# Altium project Ornament.PrjPCB
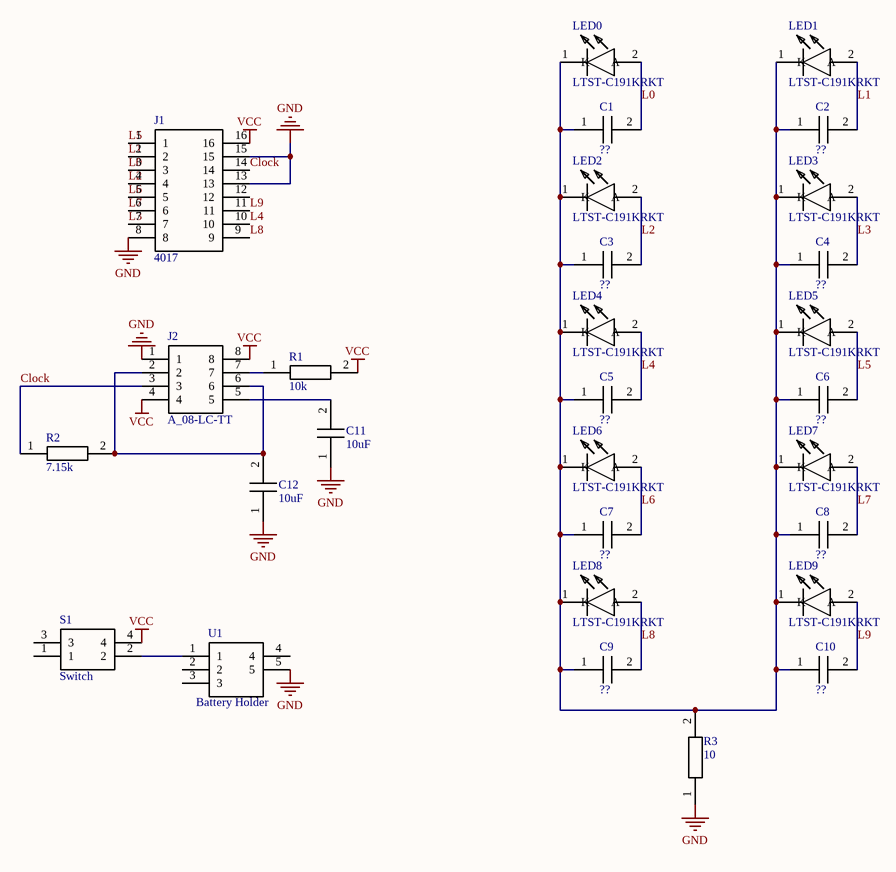
[diagram p0: Ornament.SchDoc]
1 sheet, 29 parts. Net scope: global (net labels, ports and power ports of the same name join across sheets).
Board file: Ornament.PcbDoc

## Sheet Ornament.SchDoc
size A

### Parts
C1  ??  [CAPC2013X140N]
C2  ??  [CAPC2013X140N]
C3  ??  [CAPC2013X140N]
C4  ??  [CAPC2013X140N]
C5  ??  [CAPC2013X140N]
C6  ??  [CAPC2013X140N]
C7  ??  [CAPC2013X140N]
C8  ??  [CAPC2013X140N]
C9  ??  [CAPC2013X140N]
C10  ??  [CAPC2013X140N]
C11  10uF  [CAPC2013X140N]
C12  10uF  [CAPC2013X140N]
J1  4017  [DIPS762W80P254L2019H533Q16N]
J2  A_08-LC-TT  [DIPS762W61P254L1016H525Q8N]
LED0  LTST-C191KRKT  [LEDC1608X55N]
LED1  LTST-C191KRKT  [LEDC1608X55N]
LED2  LTST-C191KRKT  [LEDC1608X55N]
LED3  LTST-C191KRKT  [LEDC1608X55N]
LED4  LTST-C191KRKT  [LEDC1608X55N]
LED5  LTST-C191KRKT  [LEDC1608X55N]
LED6  LTST-C191KRKT  [LEDC1608X55N]
LED7  LTST-C191KRKT  [LEDC1608X55N]
LED8  LTST-C191KRKT  [LEDC1608X55N]
LED9  LTST-C191KRKT  [LEDC1608X55N]
R1  10k  [RESC2012X60N]
R2  7.15k  [RESC2012X60N]
R3  10  [RESC2012X60N]
S1  Switch  [TL3305AF160QG]
U1  Battery Holder  [BATHLD001THM]

### Nets
GND: C11.1(C1) C12.1(C1) J1.8 J1.13 J1.15 J2.1 R3.1 U1.5
VCC: J1.16 J2.4 J2.8 R1.2 S1.4
Clock: J1.14 J2.3 R2.1
L0: C1.2(C2) J1.3 LED0.2(A)
L1: C2.2(C2) J1.2 LED1.2(A)
L2: C3.2(C2) J1.4 LED2.2(A)
L3: C4.2(C2) J1.7 LED3.2(A)
L4: C5.2(C2) J1.10 LED4.2(A)
L5: C6.2(C2) J1.1 LED5.2(A)
L6: C7.2(C2) J1.5 LED6.2(A)
L7: C8.2(C2) J1.6 LED7.2(A)
L8: C9.2(C2) J1.9 LED8.2(A)
L9: C10.2(C2) J1.11 LED9.2(A)
NetC1_1: C1.1(C1) C2.1(C1) C3.1(C1) C4.1(C1) C5.1(C1) C6.1(C1) C7.1(C1) C8.1(C1) C9.1(C1) C10.1(C1) LED0.1(K) LED1.1(K) LED2.1(K) LED3.1(K) LED4.1(K) LED5.1(K) LED6.1(K) LED7.1(K) LED8.1(K) LED9.1(K) R3.2
NetC11_2: C11.2(C2) J2.5
NetC12_2: C12.2(C2) J2.2 J2.6 R2.2
NetJ2_7: J2.7 R1.1
NetS1_2: S1.2 U1.1

Not connected (* = marked no-connect by the designer): J1 12; S1 1 3; U1 2 3 4

### Library data of the parts
C1-C12 = C0805C106K8PACTU: Capacitor; Manufacturer_Name: Kemet; Allied_Number: 70096892; Datasheet Link: http://componentsearchengine.com/Datasheets/3/C0805C106K8PACTU.pdf; Manufacturer_Part_Number: C0805C106K8PACTU; Mouser Part Number: 80-C0805C106K8P; Mouser Price/Stock: https://www.mouser.com/Search/Refine.aspx?Keyword=80-C0805C106K8P; RS Part Number: 8029850P; RS Price/Stock: http://uk.rs-online.com/web/p/products/8029850P; Allied Price/Stock: https://www.alliedelec.com/kemet-c0805c106k8pactu/70096892/
J1 = 4816-3000-CP: Connector; Manufacturer_Name: 3M; Allied_Number: 70237684; Datasheet Link: https://rs.componentsearchengine.com/Datasheets/2/4816-3000-CP.pdf; Height: 5.334mm; Manufacturer_Part_Number: 4816-3000-CP; Mouser Part Number: 517-4816-3000-CP; Mouser Price/Stock: https://www.mouser.com/Search/Refine.aspx?Keyword=517-4816-3000-CP; Allied Price/Stock: https://www.alliedelec.com/3m-4816-3000-cp/70237684/
J2 = A_08-LC-TT: Connector; Manufacturer_Name: ASSMANN WSW components GmbH; Manufacturer_Part_Number: A 08-LC-TT; Datasheet Link: http://www.assmann-wsw.com/fileadmin/datasheets/ASS_0810_CO.pdf; Height: 5.25mm; RS Part Number: 6742435P; RS Price/Stock: http://uk.rs-online.com/web/p/products/6742435P
LED0-LED9 = LTST-C191KRKT: LED; Manufacturer_Name: Lite-On; Datasheet Link: http://www.mouser.com/ds/2/239/S_110_LTST-C191KRKT-539838.pdf; Height: 0.55mm; Manufacturer_Part_Number: LTST-C191KRKT; Mouser Part Number: 859-LTST-C191KRKT; Mouser Price/Stock: https://www.mouser.com/Search/Refine.aspx?Keyword=859-LTST-C191KRKT; RS Part Number: 1278415P; RS Price/Stock: http://uk.rs-online.com/web/p/products/1278415P
R1-R3 = ERA6AEB7151V: Resistor; Manufacturer_Name: Panasonic; Allied_Number: 70360736; Datasheet Link: https://industrial.panasonic.com/cdbs/www-data/pdf/RDM0000/AOA0000C307.pdf; Height: 0.6mm; Manufacturer_Part_Number: ERA6AEB7151V; RS Part Number: 7426134; RS Price/Stock: https://uk.rs-online.com/web/p/products/7426134; Allied Price/Stock: https://www.alliedelec.com/panasonic-era6aeb7151v/70360736/
S1 = TL3305AF160QG: Manufacturer_Name: E-Switch; Datasheet Link: http://spec_sheets.e-switch.com/specs/P010468.pdf; Manufacturer_Part_Number: TL3305AF160QG; Mouser Part Number: 612-TL3305AF160QG; Mouser Price/Stock: https://www.mouser.com/Search/Refine.aspx?Keyword=612-TL3305AF160QG
U1 = BAT-HLD-001-THM: Undefined or Miscellaneous; Manufacturer_Name: Linx Technologies; Datasheet Link: http://www.mouser.com/datasheet/2/238/BAT-HLD-001-THM Diagram-1175214.pdf; Height: 4.2mm; Manufacturer_Part_Number: BAT-HLD-001-THM; Mouser Part Number: 712-BAT-HLD-001-THM; Mouser Price/Stock: https://www.mouser.com/Search/Refine.aspx?Keyword=712-BAT-HLD-001-THM